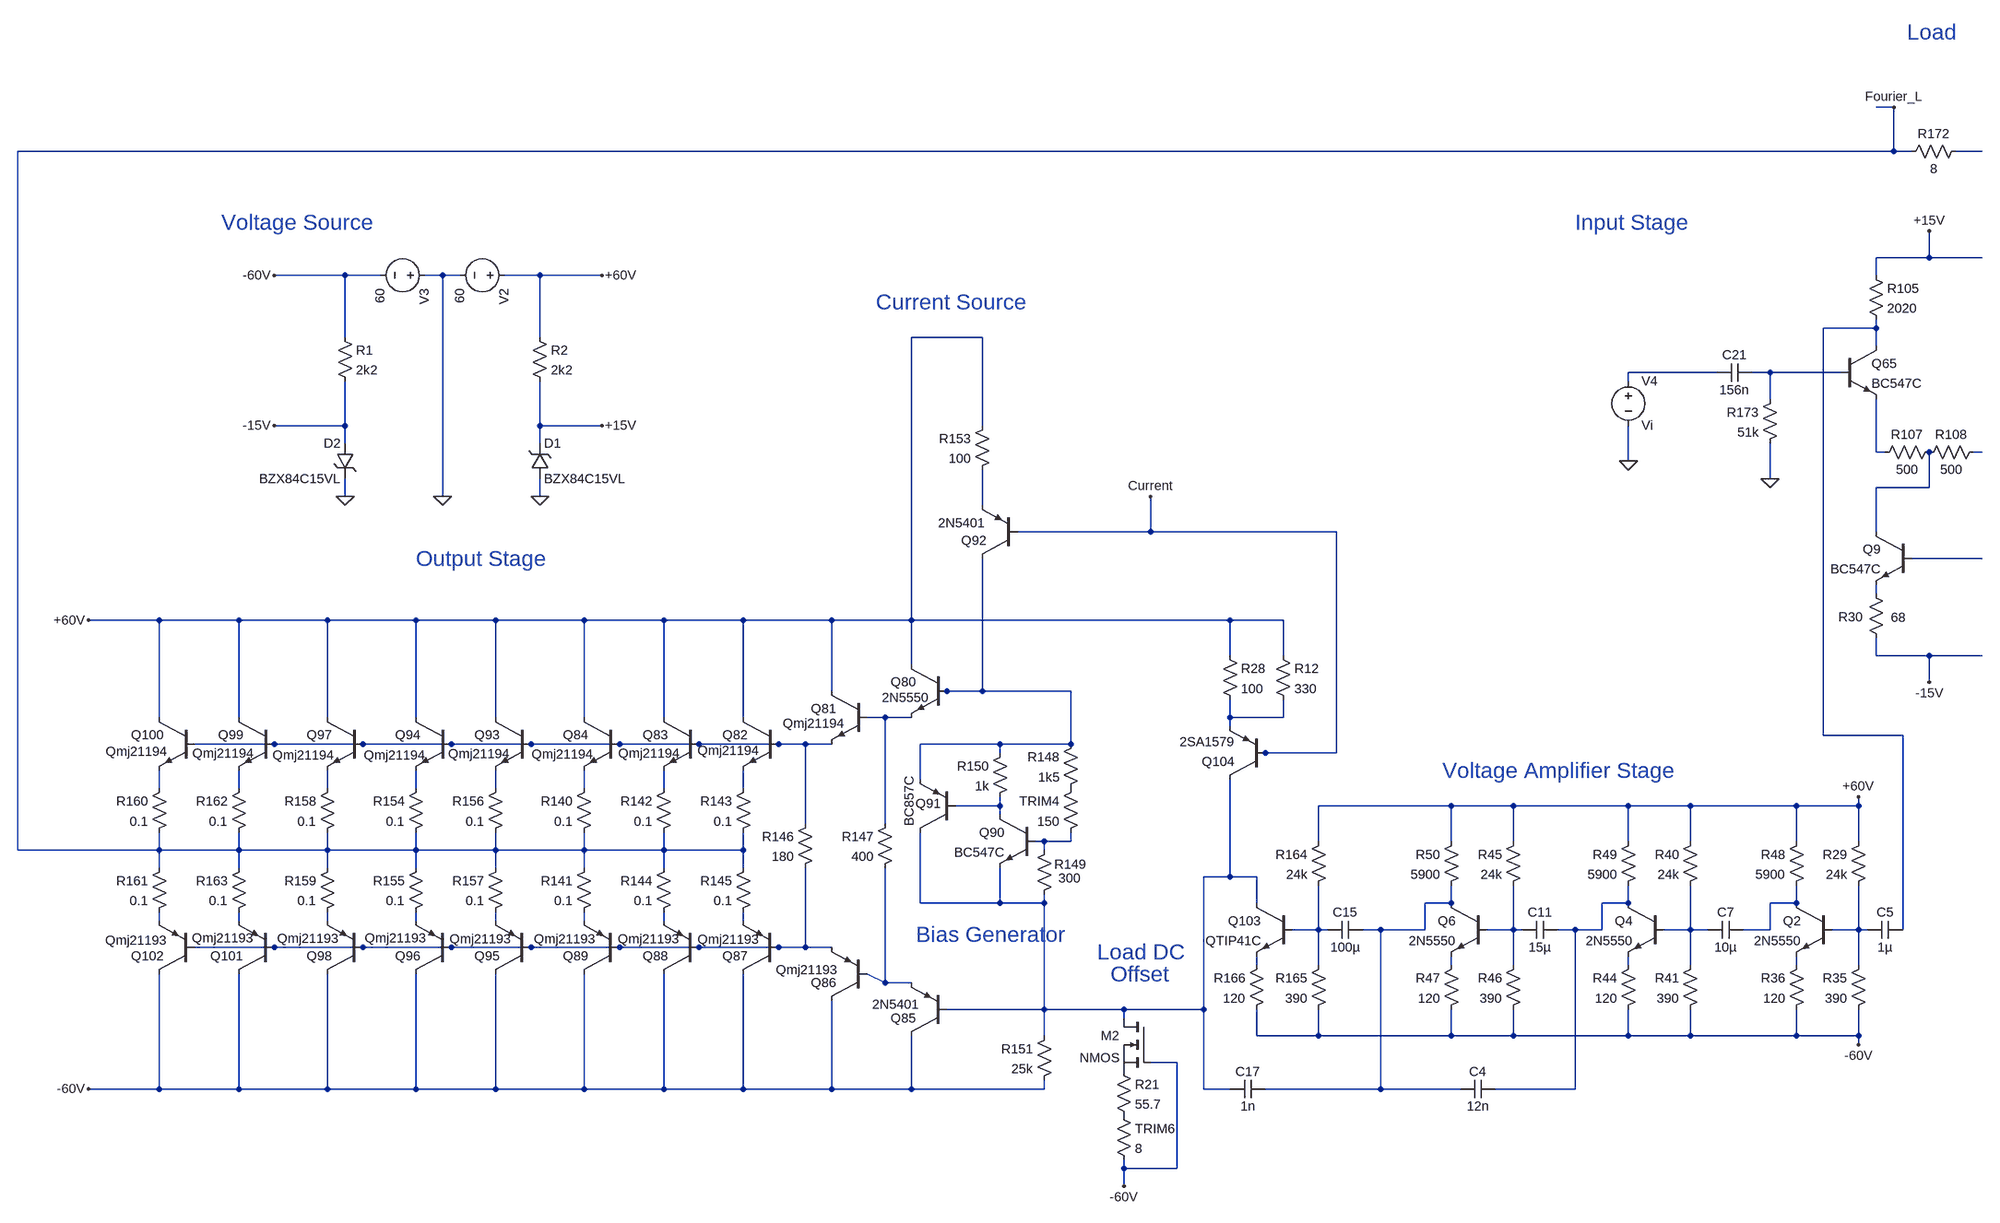
[diagram p0: schematic paltkz.asc]
paltkz.asc, the LTspice schematic file:
Version 4
SHEET 1 16980 7664
WIRE 7696 4128 7664 4128
WIRE 7696 4208 7696 4128
WIRE 7696 4208 4304 4208
WIRE 7728 4208 7696 4208
WIRE 7856 4208 7808 4208
WIRE 7760 4400 7760 4352
WIRE 7760 4400 7664 4400
WIRE 7856 4400 7760 4400
WIRE 4896 4432 4768 4432
WIRE 4960 4432 4896 4432
WIRE 5072 4432 5040 4432
WIRE 5104 4432 5072 4432
WIRE 5248 4432 5184 4432
WIRE 5360 4432 5248 4432
WIRE 7664 4432 7664 4400
WIRE 7664 4528 7664 4512
WIRE 7664 4528 7568 4528
WIRE 4896 4544 4896 4432
WIRE 5248 4544 5248 4432
WIRE 6048 4544 5920 4544
WIRE 7664 4560 7664 4528
WIRE 7376 4608 7216 4608
WIRE 7472 4608 7440 4608
WIRE 7600 4608 7472 4608
WIRE 7216 4624 7216 4608
WIRE 7472 4656 7472 4608
WIRE 4896 4704 4896 4624
WIRE 4896 4704 4768 4704
WIRE 5248 4704 5248 4624
WIRE 5360 4704 5248 4704
WIRE 6048 4704 6048 4544
WIRE 4896 4736 4896 4704
WIRE 5248 4736 5248 4704
WIRE 7664 4752 7664 4656
WIRE 7680 4752 7664 4752
WIRE 7856 4752 7840 4752
WIRE 7216 4768 7216 4704
WIRE 7472 4800 7472 4736
WIRE 7760 4816 7760 4752
WIRE 7760 4816 7664 4816
WIRE 4896 4832 4896 4800
WIRE 5072 4832 5072 4432
WIRE 5248 4832 5248 4800
WIRE 6048 4848 6048 4784
WIRE 6352 4896 6352 4832
WIRE 6352 4896 6112 4896
WIRE 6688 4896 6352 4896
WIRE 7664 4896 7664 4816
WIRE 7856 4944 7728 4944
WIRE 7664 5008 7664 4992
WIRE 4560 5056 4432 5056
WIRE 4704 5056 4560 5056
WIRE 4864 5056 4704 5056
WIRE 5024 5056 4864 5056
WIRE 5168 5056 5024 5056
WIRE 5328 5056 5168 5056
WIRE 5472 5056 5328 5056
WIRE 5616 5056 5472 5056
WIRE 5776 5056 5616 5056
WIRE 5920 5056 5920 4544
WIRE 5920 5056 5776 5056
WIRE 6496 5056 5920 5056
WIRE 6592 5056 6496 5056
WIRE 6496 5120 6496 5056
WIRE 6592 5120 6592 5056
WIRE 7664 5120 7664 5088
WIRE 7760 5120 7664 5120
WIRE 7856 5120 7760 5120
WIRE 5920 5136 5920 5056
WIRE 7760 5168 7760 5120
WIRE 5776 5184 5776 5056
WIRE 5984 5184 5968 5184
WIRE 6048 5184 6048 4944
WIRE 6048 5184 5984 5184
WIRE 6208 5184 6048 5184
WIRE 4560 5232 4560 5056
WIRE 4704 5232 4704 5056
WIRE 4864 5232 4864 5056
WIRE 5024 5232 5024 5056
WIRE 5168 5232 5168 5056
WIRE 5328 5232 5328 5056
WIRE 5472 5232 5472 5056
WIRE 5616 5232 5616 5056
WIRE 5872 5232 5840 5232
WIRE 5920 5232 5872 5232
WIRE 6496 5232 6496 5200
WIRE 6592 5232 6592 5200
WIRE 6592 5232 6496 5232
WIRE 6496 5248 6496 5232
WIRE 7568 5264 7568 4528
WIRE 7712 5264 7568 5264
WIRE 4768 5280 4624 5280
WIRE 4928 5280 4768 5280
WIRE 5088 5280 4928 5280
WIRE 5232 5280 5088 5280
WIRE 5392 5280 5232 5280
WIRE 5536 5280 5392 5280
WIRE 5680 5280 5536 5280
WIRE 5728 5280 5680 5280
WIRE 5776 5280 5728 5280
WIRE 6080 5280 5936 5280
WIRE 6208 5280 6208 5184
WIRE 6208 5280 6080 5280
WIRE 6080 5296 6080 5280
WIRE 6560 5296 6544 5296
WIRE 6688 5296 6688 4896
WIRE 6688 5296 6560 5296
WIRE 5936 5344 5936 5280
WIRE 4560 5360 4560 5328
WIRE 4704 5360 4704 5328
WIRE 4864 5360 4864 5328
WIRE 5024 5360 5024 5328
WIRE 5168 5360 5168 5328
WIRE 5328 5360 5328 5328
WIRE 5472 5360 5472 5328
WIRE 5616 5360 5616 5328
WIRE 6080 5392 6080 5376
WIRE 6080 5392 6000 5392
WIRE 6896 5392 6656 5392
WIRE 7008 5392 6896 5392
WIRE 7216 5392 7008 5392
WIRE 7328 5392 7216 5392
WIRE 7520 5392 7328 5392
WIRE 7632 5392 7632 5376
WIRE 7632 5392 7520 5392
WIRE 6080 5408 6080 5392
WIRE 5728 5424 5728 5280
WIRE 5872 5424 5872 5232
WIRE 6160 5456 6144 5456
WIRE 6208 5456 6208 5440
WIRE 6208 5456 6160 5456
WIRE 6656 5456 6656 5392
WIRE 6896 5456 6896 5392
WIRE 7008 5456 7008 5392
WIRE 7216 5456 7216 5392
WIRE 7328 5456 7328 5392
WIRE 7520 5456 7520 5392
WIRE 7632 5456 7632 5392
WIRE 4304 5472 4304 4208
WIRE 4560 5472 4560 5440
WIRE 4560 5472 4304 5472
WIRE 4704 5472 4704 5440
WIRE 4704 5472 4560 5472
WIRE 4864 5472 4864 5440
WIRE 4864 5472 4704 5472
WIRE 5024 5472 5024 5440
WIRE 5024 5472 4864 5472
WIRE 5168 5472 5168 5440
WIRE 5168 5472 5024 5472
WIRE 5328 5472 5328 5440
WIRE 5328 5472 5168 5472
WIRE 5472 5472 5472 5440
WIRE 5472 5472 5328 5472
WIRE 5616 5472 5616 5440
WIRE 5616 5472 5472 5472
WIRE 6160 5472 6160 5456
WIRE 4560 5504 4560 5472
WIRE 4704 5504 4704 5472
WIRE 4864 5504 4864 5472
WIRE 5024 5504 5024 5472
WIRE 5168 5504 5168 5472
WIRE 5328 5504 5328 5472
WIRE 5472 5504 5472 5472
WIRE 5616 5504 5616 5472
WIRE 6496 5520 6496 5344
WIRE 6496 5520 6448 5520
WIRE 6544 5520 6496 5520
WIRE 5936 5568 5936 5440
WIRE 6080 5568 6080 5504
WIRE 6080 5568 5936 5568
WIRE 6160 5568 6160 5552
WIRE 6160 5568 6080 5568
WIRE 6544 5568 6544 5520
WIRE 6896 5568 6896 5536
WIRE 6896 5568 6848 5568
WIRE 7216 5568 7216 5536
WIRE 7216 5568 7168 5568
WIRE 7520 5568 7520 5536
WIRE 7520 5568 7472 5568
WIRE 4560 5600 4560 5584
WIRE 4704 5600 4704 5584
WIRE 4864 5600 4864 5584
WIRE 5024 5600 5024 5584
WIRE 5168 5600 5168 5584
WIRE 5328 5600 5328 5584
WIRE 5472 5600 5472 5584
WIRE 5616 5600 5616 5584
WIRE 6656 5616 6656 5536
WIRE 6656 5616 6608 5616
WIRE 6672 5616 6656 5616
WIRE 6768 5616 6736 5616
WIRE 6848 5616 6848 5568
WIRE 6848 5616 6768 5616
WIRE 7008 5616 7008 5536
WIRE 7008 5616 6960 5616
WIRE 7024 5616 7008 5616
WIRE 7120 5616 7088 5616
WIRE 7168 5616 7168 5568
WIRE 7168 5616 7120 5616
WIRE 7328 5616 7328 5536
WIRE 7328 5616 7280 5616
WIRE 7360 5616 7328 5616
WIRE 7472 5616 7472 5568
WIRE 7472 5616 7424 5616
WIRE 7632 5616 7632 5536
WIRE 7632 5616 7584 5616
WIRE 7648 5616 7632 5616
WIRE 7712 5616 7712 5264
WIRE 4768 5648 4624 5648
WIRE 4928 5648 4768 5648
WIRE 5088 5648 4928 5648
WIRE 5232 5648 5088 5648
WIRE 5392 5648 5232 5648
WIRE 5536 5648 5392 5648
WIRE 5680 5648 5536 5648
WIRE 5728 5648 5728 5504
WIRE 5728 5648 5680 5648
WIRE 5776 5648 5728 5648
WIRE 6544 5680 6544 5664
WIRE 6656 5680 6656 5616
WIRE 6896 5680 6896 5664
WIRE 7008 5680 7008 5616
WIRE 7216 5680 7216 5664
WIRE 7328 5680 7328 5616
WIRE 7520 5680 7520 5664
WIRE 7632 5680 7632 5616
WIRE 5872 5712 5872 5504
WIRE 5872 5712 5840 5696
WIRE 5920 5712 5872 5712
WIRE 6160 5760 6160 5568
WIRE 6160 5760 5984 5760
WIRE 6304 5760 6160 5760
WIRE 6448 5760 6448 5520
WIRE 6448 5760 6304 5760
WIRE 6304 5776 6304 5760
WIRE 6160 5808 6160 5760
WIRE 6544 5808 6544 5760
WIRE 6656 5808 6656 5760
WIRE 6656 5808 6544 5808
WIRE 6896 5808 6896 5760
WIRE 6896 5808 6656 5808
WIRE 7008 5808 7008 5760
WIRE 7008 5808 6896 5808
WIRE 7216 5808 7216 5760
WIRE 7216 5808 7008 5808
WIRE 7328 5808 7328 5760
WIRE 7328 5808 7216 5808
WIRE 7520 5808 7520 5760
WIRE 7520 5808 7328 5808
WIRE 7632 5808 7632 5760
WIRE 7632 5808 7520 5808
WIRE 7632 5824 7632 5808
WIRE 6400 5856 6352 5856
WIRE 4560 5904 4560 5696
WIRE 4560 5904 4432 5904
WIRE 4704 5904 4704 5696
WIRE 4704 5904 4560 5904
WIRE 4864 5904 4864 5696
WIRE 4864 5904 4704 5904
WIRE 5024 5904 5024 5696
WIRE 5024 5904 4864 5904
WIRE 5168 5904 5168 5696
WIRE 5168 5904 5024 5904
WIRE 5328 5904 5328 5696
WIRE 5328 5904 5168 5904
WIRE 5472 5904 5472 5696
WIRE 5472 5904 5328 5904
WIRE 5616 5904 5616 5696
WIRE 5616 5904 5472 5904
WIRE 5776 5904 5776 5744
WIRE 5776 5904 5616 5904
WIRE 5920 5904 5920 5808
WIRE 5920 5904 5776 5904
WIRE 6160 5904 6160 5888
WIRE 6160 5904 5920 5904
WIRE 6448 5904 6448 5760
WIRE 6496 5904 6448 5904
WIRE 6768 5904 6768 5616
WIRE 6768 5904 6560 5904
WIRE 6912 5904 6768 5904
WIRE 7120 5904 7120 5616
WIRE 7120 5904 6976 5904
WIRE 6304 6048 6304 6032
WIRE 6400 6048 6400 5856
WIRE 6400 6048 6304 6048
WIRE 6304 6080 6304 6048
FLAG 5072 4832 0
FLAG 5360 4432 +60V
FLAG 4768 4432 -60V
FLAG 7760 4352 +15V
FLAG 4432 5904 -60V
FLAG 4432 5056 +60V
FLAG 7216 4768 0
FLAG 7472 4800 0
FLAG 5248 4832 0
FLAG 4896 4832 0
FLAG 5360 4704 +15V
FLAG 4768 4704 -15V
FLAG 7696 4128 Fourier_L
FLAG 7760 5168 -15V
FLAG 7632 5376 +60V
FLAG 7632 5824 -60V
FLAG 6352 4832 Current
FLAG 6304 6080 -60V
SYMBOL voltage 5200 4432 R90
WINDOW 123 0 0 Left 0
WINDOW 39 24 44 Left 2
SYMATTR InstName V2
SYMATTR Value 60
SYMBOL voltage 5056 4432 R90
WINDOW 123 0 0 Left 0
WINDOW 39 24 124 Left 2
SYMATTR InstName V3
SYMATTR Value 60
SYMBOL npn 7600 4560 R0
SYMATTR InstName Q65
SYMATTR Value BC547C
SYMBOL res 7648 4416 R0
SYMATTR InstName R105
SYMATTR Value 2020
SYMBOL res 7776 4736 R90
WINDOW 0 0 56 VBottom 2
WINDOW 3 32 56 VTop 2
SYMATTR InstName R107
SYMATTR Value 500
SYMBOL res 7856 4736 R90
WINDOW 0 0 56 VBottom 2
WINDOW 3 32 56 VTop 2
SYMATTR InstName R108
SYMATTR Value 500
SYMBOL npn 5984 5136 M0
WINDOW 3 33 60 Left 2
SYMATTR Value 2N5550
SYMATTR InstName Q80
SYMBOL npn 5840 5184 M0
WINDOW 3 41 59 Left 2
SYMATTR Value Qmj21194
SYMATTR InstName Q81
SYMBOL npn 5680 5232 M0
WINDOW 3 35 60 Left 2
SYMATTR Value Qmj21194
SYMATTR InstName Q82
SYMBOL npn 5536 5232 M0
WINDOW 3 34 65 Left 2
SYMATTR Value Qmj21194
SYMATTR InstName Q83
SYMBOL npn 5392 5232 M0
WINDOW 3 47 67 Left 2
SYMATTR Value Qmj21194
SYMATTR InstName Q84
SYMBOL pnp 5984 5808 R180
WINDOW 3 50 57 Left 2
SYMATTR Value 2N5401
SYMATTR InstName Q85
SYMBOL pnp 5840 5744 R180
WINDOW 3 53 55 Left 2
SYMATTR Value Qmj21193
SYMATTR InstName Q86
SYMBOL pnp 5680 5696 R180
WINDOW 3 35 62 Left 2
SYMATTR Value Qmj21193
SYMATTR InstName Q87
SYMBOL pnp 5536 5696 R180
WINDOW 3 35 63 Left 2
SYMATTR Value Qmj21193
SYMATTR InstName Q88
SYMBOL pnp 5392 5696 R180
WINDOW 3 43 63 Left 2
SYMATTR Value Qmj21193
SYMATTR InstName Q89
SYMBOL res 5344 5344 M0
SYMATTR InstName R140
SYMATTR Value 0.1
SYMBOL res 5344 5488 M0
SYMATTR InstName R141
SYMATTR Value 0.1
SYMBOL res 5488 5344 M0
SYMATTR InstName R142
SYMATTR Value 0.1
SYMBOL res 5632 5344 M0
SYMATTR InstName R143
SYMATTR Value 0.1
SYMBOL res 5488 5488 M0
SYMATTR InstName R144
SYMATTR Value 0.1
SYMBOL res 5632 5488 M0
SYMATTR InstName R145
SYMATTR Value 0.1
SYMBOL res 5744 5408 M0
SYMATTR InstName R146
SYMATTR Value 180
SYMBOL res 5888 5408 M0
SYMATTR InstName R147
SYMATTR Value 400
SYMBOL npn 6144 5408 M0
SYMATTR InstName Q90
SYMATTR Value BC547C
SYMBOL res 6224 5264 M0
SYMATTR InstName R148
SYMATTR Value 1k5
SYMBOL res 6176 5456 M0
WINDOW 0 -60 42 Left 2
WINDOW 3 -50 67 Left 2
SYMATTR InstName R149
SYMATTR Value 300
SYMBOL res 6096 5280 M0
SYMATTR InstName R150
SYMATTR Value 1k
SYMBOL pnp 6000 5440 R180
WINDOW 0 27 52 Left 2
WINDOW 3 84 11 VRight 2
SYMATTR InstName Q91
SYMATTR Value BC857C
SYMBOL res 6176 5792 M0
SYMATTR InstName R151
SYMATTR Value 25k
SYMBOL pnp 6112 4944 R180
WINDOW 3 59 64 Left 2
SYMATTR Value 2N5401
SYMATTR InstName Q92
SYMBOL res 6064 4688 M0
SYMATTR InstName R153
SYMATTR Value 100
SYMBOL npn 5232 5232 M0
WINDOW 3 38 66 Left 2
SYMATTR Value Qmj21194
SYMATTR InstName Q93
SYMBOL npn 5088 5232 M0
WINDOW 3 46 68 Left 2
SYMATTR Value Qmj21194
SYMATTR InstName Q94
SYMBOL pnp 5232 5696 R180
WINDOW 3 35 63 Left 2
SYMATTR Value Qmj21193
SYMATTR InstName Q95
SYMBOL pnp 5088 5696 R180
WINDOW 3 45 65 Left 2
SYMATTR Value Qmj21193
SYMATTR InstName Q96
SYMBOL res 5040 5344 M0
SYMATTR InstName R154
SYMATTR Value 0.1
SYMBOL res 5040 5488 M0
SYMATTR InstName R155
SYMATTR Value 0.1
SYMBOL res 5184 5344 M0
SYMATTR InstName R156
SYMATTR Value 0.1
SYMBOL res 5184 5488 M0
SYMATTR InstName R157
SYMATTR Value 0.1
SYMBOL npn 4928 5232 M0
WINDOW 3 51 68 Left 2
SYMATTR Value Qmj21194
SYMATTR InstName Q97
SYMBOL pnp 4928 5696 R180
WINDOW 3 43 64 Left 2
SYMATTR Value Qmj21193
SYMATTR InstName Q98
SYMBOL res 4880 5344 M0
SYMATTR InstName R158
SYMATTR Value 0.1
SYMBOL res 4880 5488 M0
SYMATTR InstName R159
SYMATTR Value 0.1
SYMBOL npn 4768 5232 M0
WINDOW 3 36 65 Left 2
SYMATTR Value Qmj21194
SYMATTR InstName Q99
SYMBOL npn 4624 5232 M0
WINDOW 3 49 62 Left 2
SYMATTR Value Qmj21194
SYMATTR InstName Q100
SYMBOL pnp 4768 5696 R180
WINDOW 3 37 65 Left 2
SYMATTR Value Qmj21193
SYMATTR InstName Q101
SYMBOL pnp 4624 5696 R180
WINDOW 3 50 61 Left 2
SYMATTR Value Qmj21193
SYMATTR InstName Q102
SYMBOL res 4576 5344 M0
SYMATTR InstName R160
SYMATTR Value 0.1
SYMBOL res 4576 5488 M0
SYMATTR InstName R161
SYMATTR Value 0.1
SYMBOL res 4720 5344 M0
SYMATTR InstName R162
SYMATTR Value 0.1
SYMBOL res 4720 5488 M0
SYMATTR InstName R163
SYMATTR Value 0.1
SYMBOL res 6672 5440 M0
SYMATTR InstName R164
SYMATTR Value 24k
SYMBOL res 6672 5664 M0
SYMATTR InstName R165
SYMATTR Value 390
SYMBOL npn 6608 5568 M0
SYMATTR InstName Q103
SYMATTR Value QTIP41C
SYMBOL res 6560 5664 M0
SYMATTR InstName R166
SYMATTR Value 120
SYMBOL pnp 6560 5344 R180
SYMATTR InstName Q104
SYMATTR Value 2SA1579
SYMBOL cap 6496 5888 M90
WINDOW 0 0 32 VBottom 2
WINDOW 3 32 32 VTop 2
SYMATTR InstName C17
SYMATTR Value 1n
SYMATTR SpiceLine Rser=0.1
SYMBOL voltage 7216 4608 R0
WINDOW 123 24 124 Left 2
WINDOW 39 0 0 Left 0
SYMATTR InstName V4
SYMATTR Value Vi
SYMBOL cap 7440 4592 R90
WINDOW 0 0 32 VBottom 2
WINDOW 3 32 32 VTop 2
SYMATTR InstName C21
SYMATTR Value 156n
SYMATTR SpiceLine Rser=0.1
SYMBOL res 7488 4640 M0
SYMATTR InstName R173
SYMATTR Value 51k
SYMBOL res 7824 4192 R90
WINDOW 0 0 56 VBottom 2
WINDOW 3 32 56 VTop 2
SYMATTR InstName R172
SYMATTR Value 8
SYMBOL zener 5232 4800 M180
WINDOW 0 24 64 Left 2
WINDOW 3 24 0 Left 2
SYMATTR InstName D1
SYMATTR Value BZX84C15VL
SYMBOL zener 4912 4736 M0
SYMATTR InstName D2
SYMATTR Value BZX84C15VL
SYMBOL npn 7728 4896 M0
SYMATTR InstName Q9
SYMATTR Value BC547C
SYMBOL res 7648 4992 R0
WINDOW 0 -52 58 Left 2
WINDOW 3 43 59 Left 2
SYMATTR InstName R30
SYMATTR Value 68
SYMBOL res 6480 5104 R0
SYMATTR InstName R28
SYMATTR Value 100
SYMBOL cap 6672 5600 M90
WINDOW 0 0 32 VBottom 2
WINDOW 3 32 32 VTop 2
SYMATTR InstName C15
SYMATTR Value 100µ
SYMATTR SpiceLine Rser=0.1
SYMBOL res 7648 5440 M0
SYMATTR InstName R29
SYMATTR Value 24k
SYMBOL res 7648 5664 M0
SYMATTR InstName R35
SYMATTR Value 390
SYMBOL npn 7584 5568 M0
SYMATTR InstName Q2
SYMATTR Value 2N5550
SYMBOL res 7536 5664 M0
SYMATTR InstName R36
SYMATTR Value 120
SYMBOL res 7344 5440 M0
SYMATTR InstName R40
SYMATTR Value 24k
SYMBOL res 7344 5664 M0
SYMATTR InstName R41
SYMATTR Value 390
SYMBOL npn 7280 5568 M0
SYMATTR InstName Q4
SYMATTR Value 2N5550
SYMBOL res 7232 5664 M0
SYMATTR InstName R44
SYMATTR Value 120
SYMBOL res 7024 5440 M0
SYMATTR InstName R45
SYMATTR Value 24k
SYMBOL res 7024 5664 M0
SYMATTR InstName R46
SYMATTR Value 390
SYMBOL npn 6960 5568 M0
SYMATTR InstName Q6
SYMATTR Value 2N5550
SYMBOL res 6912 5664 M0
SYMATTR InstName R47
SYMATTR Value 120
SYMBOL res 7536 5440 M0
SYMATTR InstName R48
SYMATTR Value 5900
SYMBOL res 7232 5440 M0
SYMATTR InstName R49
SYMATTR Value 5900
SYMBOL res 6912 5440 M0
SYMATTR InstName R50
SYMATTR Value 5900
SYMBOL cap 6976 5888 R90
WINDOW 0 0 32 VBottom 2
WINDOW 3 32 32 VTop 2
SYMATTR InstName C4
SYMATTR Value 12n
SYMATTR SpiceLine Rser=0.1
SYMBOL cap 7648 5600 M90
WINDOW 0 0 32 VBottom 2
WINDOW 3 32 32 VTop 2
SYMATTR InstName C5
SYMATTR Value 1µ
SYMBOL cap 7360 5600 M90
WINDOW 0 0 32 VBottom 2
WINDOW 3 32 32 VTop 2
SYMATTR InstName C7
SYMATTR Value 10µ
SYMBOL cap 7024 5600 M90
WINDOW 0 0 32 VBottom 2
WINDOW 3 32 32 VTop 2
SYMATTR InstName C11
SYMATTR Value 15µ
SYMBOL res 6576 5104 R0
SYMATTR InstName R12
SYMATTR Value 330
SYMBOL res 6224 5344 M0
SYMATTR InstName TRIM4
SYMATTR Value 150
SYMBOL res 6288 5856 R0
SYMATTR InstName R21
SYMATTR Value 55.7
SYMBOL res 6288 5936 R0
SYMATTR InstName TRIM6
SYMATTR Value 8
SYMBOL res 4880 4528 R0
SYMATTR InstName R1
SYMATTR Value 2k2
SYMBOL res 5232 4528 R0
SYMATTR InstName R2
SYMATTR Value 2k2
SYMBOL nmos 6352 5776 M0
SYMATTR InstName M2
TEXT 4672 4336 Left 4 ;Voltage Source
TEXT 6880 5328 Left 4 ;Voltage Amplifier Stage
TEXT 7120 4336 Left 4 ;Input Stage
TEXT 5024 4944 Left 4 ;Output Stage
TEXT 7720 3992 Left 4 ;Load
TEXT 5856 4480 Left 4 ;Current Source
TEXT 5928 5624 Left 4 ;Bias Generator
TEXT 6256 5656 Left 4 ;Load DC
TEXT 6280 5696 Left 4 ;Offset

The netlist it stands for:
* paltkz.asc
V2 +60V 0 60
V3 0 -60V 60
Q65 N002 N004 N005 0 BC547C
R105 +15V N002 2020
R107 N007 N005 500
R108 N006 N007 500
Q80 +60V N011 N012 0 2N5550
Q81 +60V N012 N014 0 Qmj21194
Q82 +60V N014 N022 0 Qmj21194
Q83 +60V N014 N021 0 Qmj21194
Q84 +60V N014 N020 0 Qmj21194
Q85 -60V N025 N046 0 2N5401
Q86 -60V N046 N041 0 Qmj21193
Q87 -60V N041 N036 0 Qmj21193
Q88 -60V N041 N035 0 Qmj21193
Q89 -60V N041 N034 0 Qmj21193
R140 N020 Fourier_L 0.1
R141 Fourier_L N034 0.1
R142 N021 Fourier_L 0.1
R143 N022 Fourier_L 0.1
R144 Fourier_L N035 0.1
R145 Fourier_L N036 0.1
R146 N014 N041 180
R147 N012 N046 400
Q90 N023 N024 N025 0 BC547C
R148 N011 P001 1k5
R149 N024 N025 300
R150 N011 N023 1k
Q91 N025 N023 N011 0 BC857C
R151 N025 -60V 25k
Q92 N011 Current N008 0 2N5401
R153 +60V N008 100
Q93 +60V N014 N019 0 Qmj21194
Q94 +60V N014 N018 0 Qmj21194
Q95 -60V N041 N033 0 Qmj21193
Q96 -60V N041 N032 0 Qmj21193
R154 N018 Fourier_L 0.1
R155 Fourier_L N032 0.1
R156 N019 Fourier_L 0.1
R157 Fourier_L N033 0.1
Q97 +60V N014 N017 0 Qmj21194
Q98 -60V N041 N031 0 Qmj21193
R158 N017 Fourier_L 0.1
R159 Fourier_L N031 0.1
Q99 +60V N014 N016 0 Qmj21194
Q100 +60V N014 N015 0 Qmj21194
Q101 -60V N041 N030 0 Qmj21193
Q102 -60V N041 N029 0 Qmj21193
R160 N015 Fourier_L 0.1
R161 Fourier_L N029 0.1
R162 N016 Fourier_L 0.1
R163 Fourier_L N030 0.1
R164 +60V N037 24k
R165 N037 -60V 390
Q103 N025 N037 N042 0 QTIP41C
R166 N042 -60V 120
Q104 N025 Current N013 0 2SA1579
C17 N025 N026 1n Rser=0.1
V4 N003 0 Vi
C21 N004 N003 156n Rser=0.1
R173 N004 0 51k
R172 N001 Fourier_L 8
D1 0 +15V BZX84C15VL
D2 -15V 0 BZX84C15VL
Q9 N007 N009 N010 0 BC547C
R30 N010 -15V 68
R28 +60V N013 100
C15 N037 N026 100µ Rser=0.1
R29 +60V N040 24k
R35 N040 -60V 390
Q2 N028 N040 N045 0 2N5550
R36 N045 -60V 120
R40 +60V N039 24k
R41 N039 -60V 390
Q4 N027 N039 N044 0 2N5550
R44 N044 -60V 120
R45 +60V N038 24k
R46 N038 -60V 390
Q6 N026 N038 N043 0 2N5550
R47 N043 -60V 120
R48 +60V N028 5900
R49 +60V N027 5900
R50 +60V N026 5900
C4 N027 N026 12n Rser=0.1
C5 N040 N002 1µ
C7 N039 N028 10µ
C11 N038 N027 15µ
R12 +60V N013 330
R§TRIM4 P001 N024 150
R21 P002 P003 55.7
R§TRIM6 P003 -60V 8
R1 -60V -15V 2k2
R2 +60V +15V 2k2
M2 N025 -60V P002 P002 NMOS
.model D D
.lib standard.dio
.model NPN NPN
.model PNP PNP
.lib standard.bjt
.model NMOS NMOS
.model PMOS PMOS
.lib standard.mos
* Voltage Source
* Voltage Amplifier Stage
* Input Stage
* Output Stage
* Load
* Current Source
* Bias Generator
* Load DC
* Offset
.backanno
.end